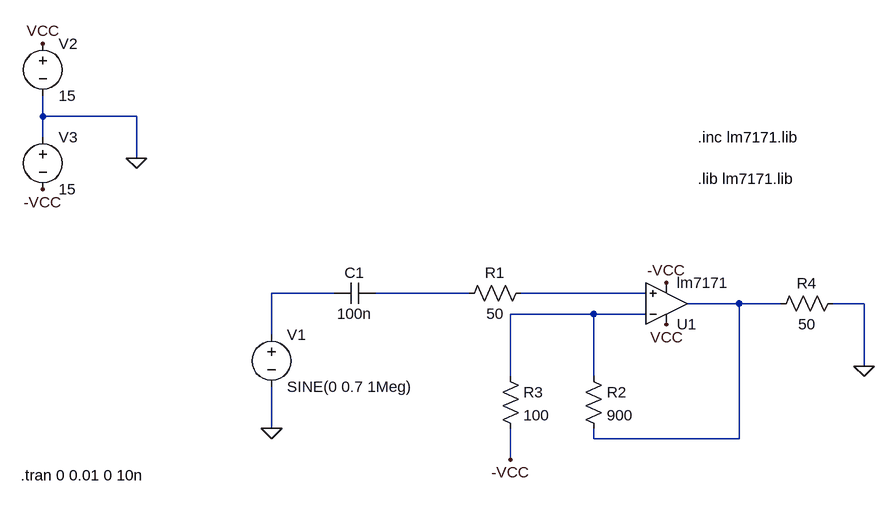
[diagram p0: schematic ampusrp.asc]
ampusrp.asc, the LTspice schematic file:
Version 4
SHEET 1 880 680
WIRE -480 -160 -480 -192
WIRE -336 -160 -480 -160
WIRE -480 -128 -480 -160
WIRE -336 -96 -336 -160
WIRE -32 112 -128 112
WIRE 176 112 32 112
WIRE 448 112 256 112
WIRE 592 128 512 128
WIRE 656 128 592 128
WIRE 784 128 736 128
WIRE 368 144 240 144
WIRE 448 144 368 144
WIRE -128 176 -128 112
WIRE 784 224 784 128
WIRE 240 240 240 144
WIRE 368 240 368 144
WIRE -128 320 -128 256
WIRE 368 336 368 320
WIRE 592 336 592 128
WIRE 592 336 368 336
WIRE 240 368 240 320
FLAG 784 224 0
FLAG -336 -96 0
FLAG -480 -48 -VCC
FLAG 480 96 -VCC
FLAG -480 -272 VCC
FLAG 480 160 VCC
FLAG -128 320 0
FLAG 240 368 -VCC
SYMBOL cap 32 96 R90
WINDOW 0 0 32 VBottom 2
WINDOW 3 32 32 VTop 2
SYMATTR InstName C1
SYMATTR Value 100n
SYMBOL res 272 96 R90
WINDOW 0 0 56 VBottom 2
WINDOW 3 32 56 VTop 2
SYMATTR InstName R1
SYMATTR Value 50
SYMBOL OpAmps\\opamp2 480 192 M180
SYMATTR InstName U1
SYMATTR Value lm7171
SYMATTR SpiceModel lm7171
SYMBOL res 352 224 R0
SYMATTR InstName R2
SYMATTR Value 900
SYMBOL res 224 224 R0
SYMATTR InstName R3
SYMATTR Value 100
SYMBOL res 752 112 R90
WINDOW 0 0 56 VBottom 2
WINDOW 3 32 56 VTop 2
SYMATTR InstName R4
SYMATTR Value 50
SYMBOL voltage -128 160 R0
WINDOW 123 0 0 Left 0
WINDOW 39 0 0 Left 0
SYMATTR InstName V1
SYMATTR Value SINE(0 0.7 1Meg)
SYMBOL voltage -480 -288 R0
WINDOW 123 0 0 Left 0
WINDOW 39 0 0 Left 0
SYMATTR InstName V2
SYMATTR Value 15
SYMBOL voltage -480 -144 R0
WINDOW 123 0 0 Left 0
WINDOW 39 0 0 Left 0
SYMATTR InstName V3
SYMATTR Value 15
TEXT -514 392 Left 2 !.tran 0 0.01 0 10n
TEXT 528 -64 Left 2 !.lib lm7171.lib
TEXT 528 -128 Left 2 !.inc lm7171.lib

The netlist it stands for:
* ampusrp.asc
C1 N002 N001 100n
R1 N003 N002 50
XU1 N003 N005 VCC -VCC N004 lm7171 lm7171  ; pins In+ In- V+ V- OUT
R2 N005 N004 900
R3 N005 -VCC 100
R4 0 N004 50
V1 N001 0 SINE(0 0.7 1Meg)
V2 VCC 0 15
V3 0 -VCC 15
.tran 0 0.01 0 10n
.lib lm7171.lib
.inc lm7171.lib
.backanno
.end